# Altium schematic sheet 9.Pwm_Buffer.SchDoc
size A3; SheetNumber: 10; SheetTotal: 10
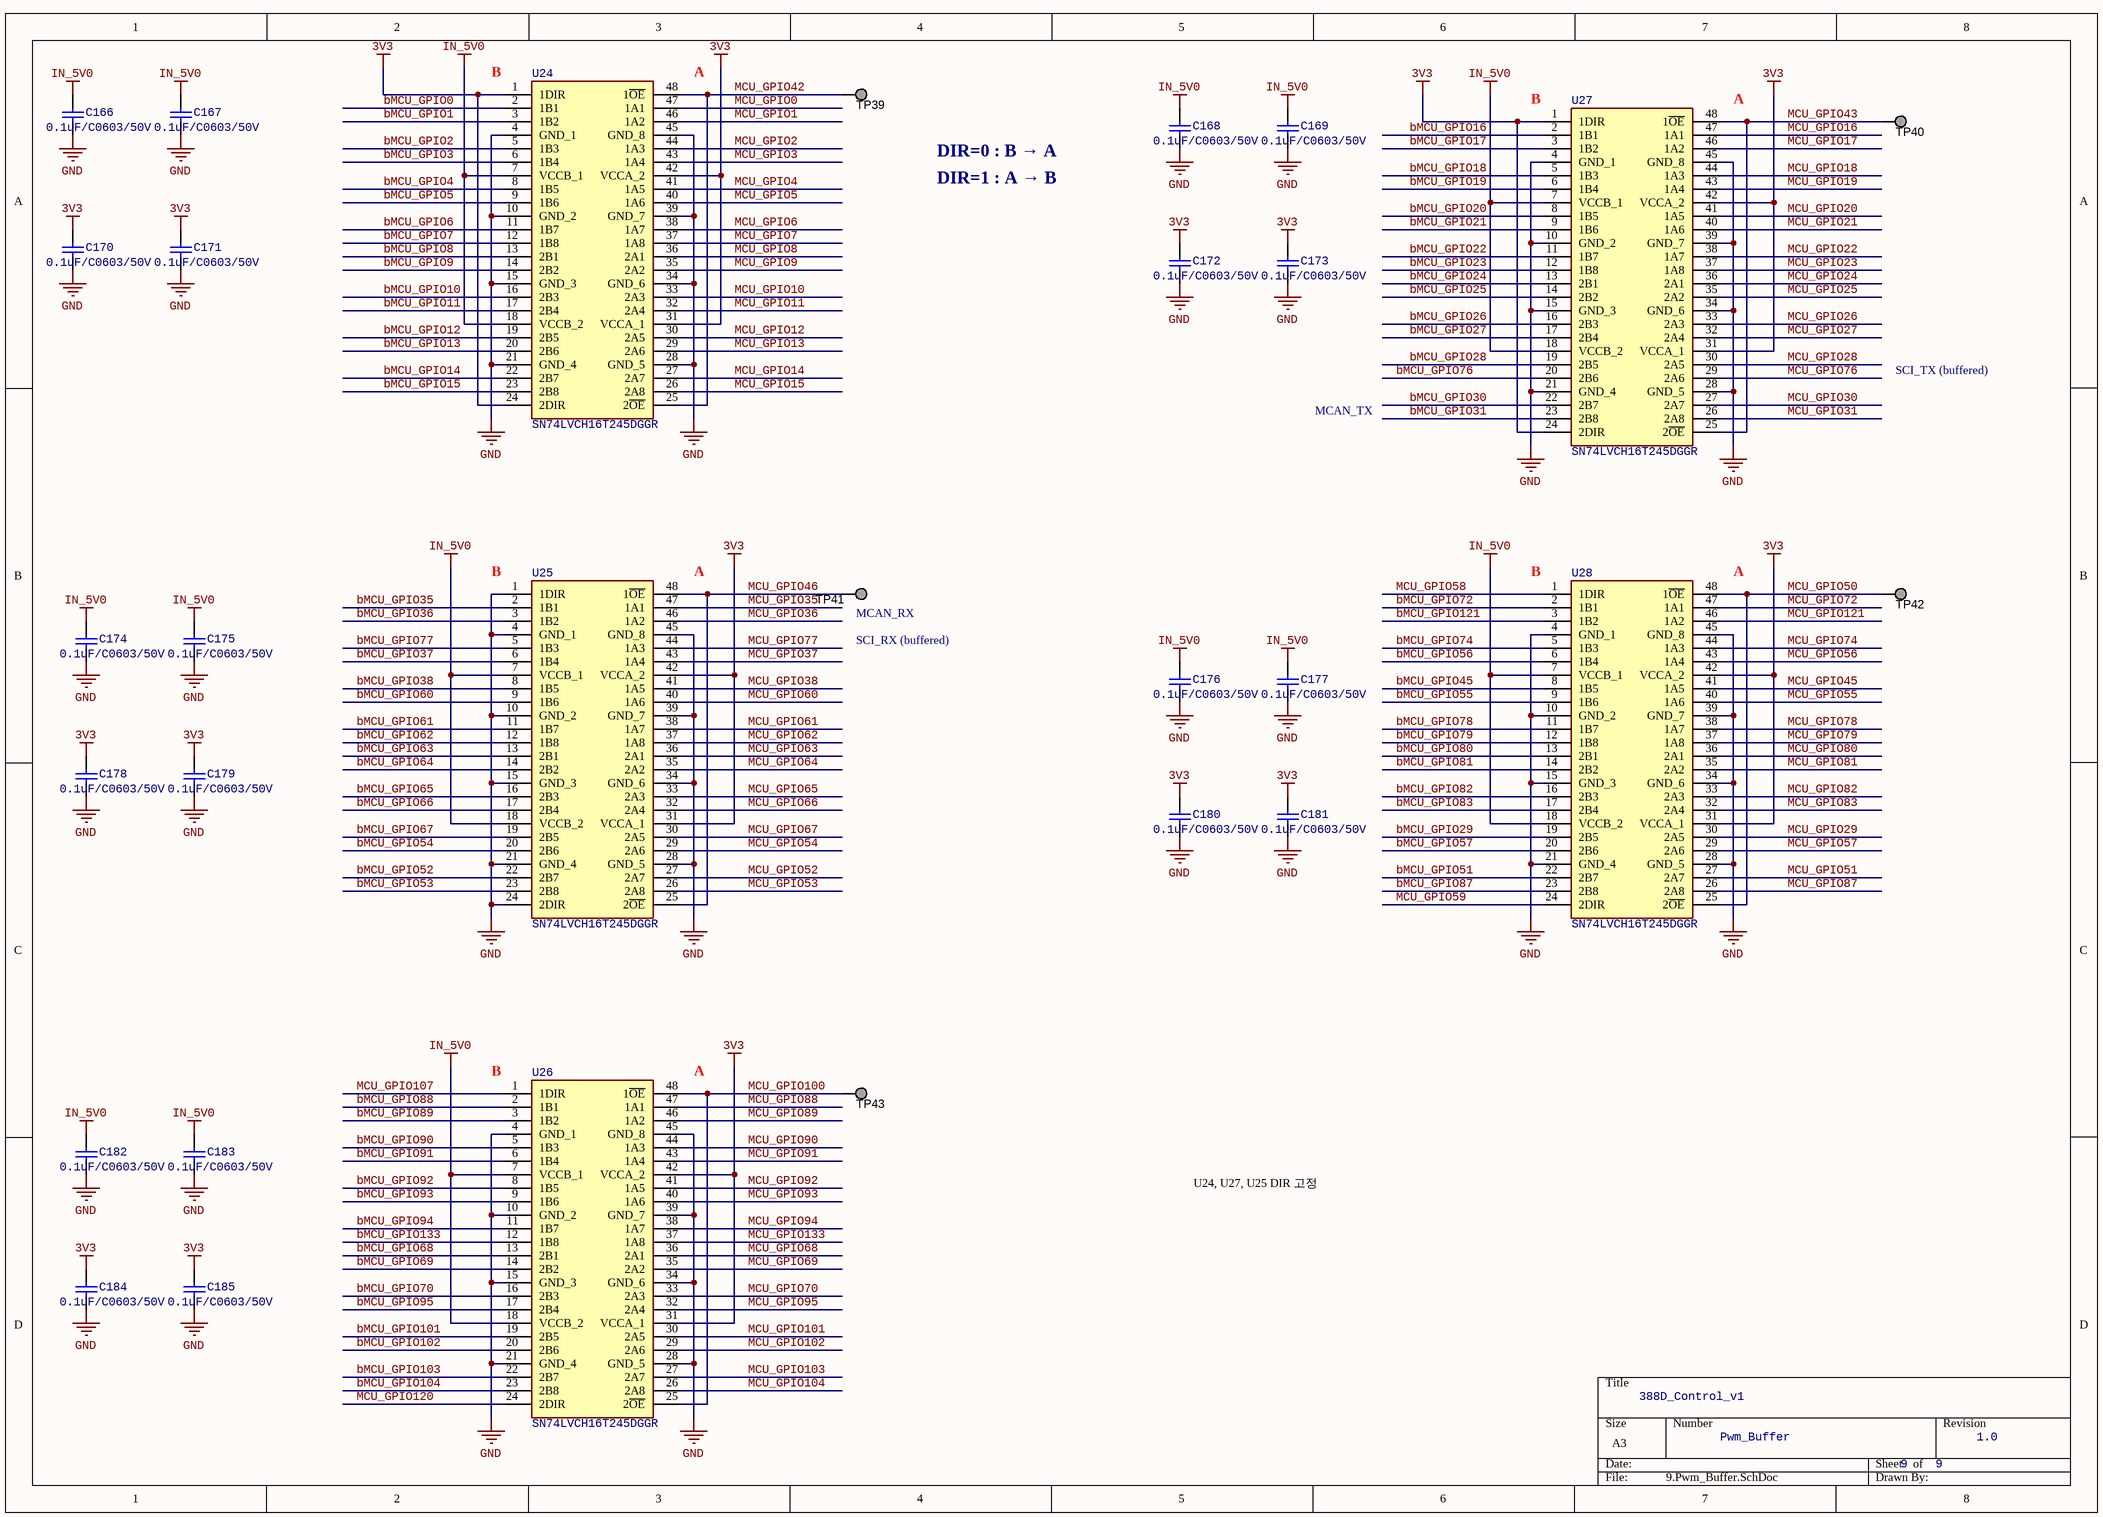
[diagram p0: 9.Pwm_Buffer.SchDoc]

## Parts
C166  value 0.1uF/C0603/50V  [CAPC1608X90X40NL10T20]  (hidden comment: Capacitor 100 nF +/-10% 50 V 0603)
C167  value 0.1uF/C0603/50V  [CAPC1608X90X40NL10T20]  (hidden comment: Capacitor 100 nF +/-10% 50 V 0603)
C168  value 0.1uF/C0603/50V  [CAPC1608X90X40NL10T20]  (hidden comment: Capacitor 100 nF +/-10% 50 V 0603)
C169  value 0.1uF/C0603/50V  [CAPC1608X90X40NL10T20]  (hidden comment: Capacitor 100 nF +/-10% 50 V 0603)
C170  value 0.1uF/C0603/50V  [CAPC1608X90X40NL10T20]  (hidden comment: Capacitor 100 nF +/-10% 50 V 0603)
C171  value 0.1uF/C0603/50V  [CAPC1608X90X40NL10T20]  (hidden comment: Capacitor 100 nF +/-10% 50 V 0603)
C172  value 0.1uF/C0603/50V  [CAPC1608X90X40NL10T20]  (hidden comment: Capacitor 100 nF +/-10% 50 V 0603)
C173  value 0.1uF/C0603/50V  [CAPC1608X90X40NL10T20]  (hidden comment: Capacitor 100 nF +/-10% 50 V 0603)
C174  value 0.1uF/C0603/50V  [CAPC1608X90X40NL10T20]  (hidden comment: Capacitor 100 nF +/-10% 50 V 0603)
C175  value 0.1uF/C0603/50V  [CAPC1608X90X40NL10T20]  (hidden comment: Capacitor 100 nF +/-10% 50 V 0603)
C176  value 0.1uF/C0603/50V  [CAPC1608X90X40NL10T20]  (hidden comment: Capacitor 100 nF +/-10% 50 V 0603)
C177  value 0.1uF/C0603/50V  [CAPC1608X90X40NL10T20]  (hidden comment: Capacitor 100 nF +/-10% 50 V 0603)
C178  value 0.1uF/C0603/50V  [CAPC1608X90X40NL10T20]  (hidden comment: Capacitor 100 nF +/-10% 50 V 0603)
C179  value 0.1uF/C0603/50V  [CAPC1608X90X40NL10T20]  (hidden comment: Capacitor 100 nF +/-10% 50 V 0603)
C180  value 0.1uF/C0603/50V  [CAPC1608X90X40NL10T20]  (hidden comment: Capacitor 100 nF +/-10% 50 V 0603)
C181  value 0.1uF/C0603/50V  [CAPC1608X90X40NL10T20]  (hidden comment: Capacitor 100 nF +/-10% 50 V 0603)
C182  value 0.1uF/C0603/50V  [CAPC1608X90X40NL10T20]  (hidden comment: Capacitor 100 nF +/-10% 50 V 0603)
C183  value 0.1uF/C0603/50V  [CAPC1608X90X40NL10T20]  (hidden comment: Capacitor 100 nF +/-10% 50 V 0603)
C184  value 0.1uF/C0603/50V  [CAPC1608X90X40NL10T20]  (hidden comment: Capacitor 100 nF +/-10% 50 V 0603)
C185  value 0.1uF/C0603/50V  [CAPC1608X90X40NL10T20]  (hidden comment: Capacitor 100 nF +/-10% 50 V 0603)
TP39  TESTPOINT  [TP_50MIL-25MILHOLE]  (value not drawn)  (no BOM)
TP40  TESTPOINT  [TP_50MIL-25MILHOLE]  (value not drawn)  (no BOM)
TP41  TESTPOINT  [TP_50MIL-25MILHOLE]  (value not drawn)  (no BOM)
TP42  TESTPOINT  [TP_50MIL-25MILHOLE]  (value not drawn)  (no BOM)
TP43  TESTPOINT  [TP_50MIL-25MILHOLE]  (value not drawn)  (no BOM)
U24  SN74LVCH16T245DGGR  [SOP50P810X120-48N]
U25  SN74LVCH16T245DGGR  [SOP50P810X120-48N]
U26  SN74LVCH16T245DGGR  [SOP50P810X120-48N]
U27  SN74LVCH16T245DGGR  [SOP50P810X120-48N]
U28  SN74LVCH16T245DGGR  [SOP50P810X120-48N]

## Nets
3V3: C170.1 C171.1 C172.1 C173.1 C178.1 C179.1 C180.1 C181.1 C184.1 C185.1 U24.1(1DIR) U24.24(2DIR) U24.31(VCCA_1) U24.42(VCCA_2) U25.31(VCCA_1) U25.42(VCCA_2) U26.31(VCCA_1) U26.42(VCCA_2) U27.1(1DIR) U27.24(2DIR) U27.31(VCCA_1) U27.42(VCCA_2) U28.31(VCCA_1) U28.42(VCCA_2)
GND: C166.2 C167.2 C168.2 C169.2 C170.2 C171.2 C172.2 C173.2 C174.2 C175.2 C176.2 C177.2 C178.2 C179.2 C180.2 C181.2 C182.2 C183.2 C184.2 C185.2 U24.4(GND_1) U24.10(GND_2) U24.15(GND_3) U24.21(GND_4) U24.28(GND_5) U24.34(GND_6) U24.39(GND_7) U24.45(GND_8) U25.1(1DIR) U25.4(GND_1) U25.10(GND_2) U25.15(GND_3) U25.21(GND_4) U25.24(2DIR) U25.28(GND_5) U25.34(GND_6) U25.39(GND_7) U25.45(GND_8) U26.4(GND_1) U26.10(GND_2) U26.15(GND_3) U26.21(GND_4) U26.28(GND_5) U26.34(GND_6) U26.39(GND_7) U26.45(GND_8) U27.4(GND_1) U27.10(GND_2) U27.15(GND_3) U27.21(GND_4) U27.28(GND_5) U27.34(GND_6) U27.39(GND_7) U27.45(GND_8) U28.4(GND_1) U28.10(GND_2) U28.15(GND_3) U28.21(GND_4) U28.28(GND_5) U28.34(GND_6) U28.39(GND_7) U28.45(GND_8)
IN_5V0: C166.1 C167.1 C168.1 C169.1 C174.1 C175.1 C176.1 C177.1 C182.1 C183.1 U24.7(VCCB_1) U24.18(VCCB_2) U25.7(VCCB_1) U25.18(VCCB_2) U26.7(VCCB_1) U26.18(VCCB_2) U27.7(VCCB_1) U27.18(VCCB_2) U28.7(VCCB_1) U28.18(VCCB_2)
bMCU_GPIO0: U24.2(1B1)
bMCU_GPIO1: U24.3(1B2)
bMCU_GPIO2: U24.5(1B3)
bMCU_GPIO3: U24.6(1B4)
bMCU_GPIO4: U24.8(1B5)
bMCU_GPIO5: U24.9(1B6)
bMCU_GPIO6: U24.11(1B7)
bMCU_GPIO7: U24.12(1B8)
bMCU_GPIO8: U24.13(2B1)
bMCU_GPIO9: U24.14(2B2)
bMCU_GPIO10: U24.16(2B3)
bMCU_GPIO11: U24.17(2B4)
bMCU_GPIO12: U24.19(2B5)
bMCU_GPIO13: U24.20(2B6)
bMCU_GPIO14: U24.22(2B7)
bMCU_GPIO15: U24.23(2B8)
bMCU_GPIO16: U27.2(1B1)
bMCU_GPIO17: U27.3(1B2)
bMCU_GPIO18: U27.5(1B3)
bMCU_GPIO19: U27.6(1B4)
bMCU_GPIO20: U27.8(1B5)
bMCU_GPIO21: U27.9(1B6)
bMCU_GPIO22: U27.11(1B7)
bMCU_GPIO23: U27.12(1B8)
bMCU_GPIO24: U27.13(2B1)
bMCU_GPIO25: U27.14(2B2)
bMCU_GPIO26: U27.16(2B3)
bMCU_GPIO27: U27.17(2B4)
bMCU_GPIO28: U27.19(2B5)
bMCU_GPIO29: U28.19(2B5)
bMCU_GPIO30: U27.22(2B7)
bMCU_GPIO31: U27.23(2B8)
bMCU_GPIO35: U25.2(1B1)
bMCU_GPIO36: U25.3(1B2)
bMCU_GPIO37: U25.6(1B4)
bMCU_GPIO38: U25.8(1B5)
bMCU_GPIO45: U28.8(1B5)
bMCU_GPIO51: U28.22(2B7)
bMCU_GPIO52: U25.22(2B7)
bMCU_GPIO53: U25.23(2B8)
bMCU_GPIO54: U25.20(2B6)
bMCU_GPIO55: U28.9(1B6)
bMCU_GPIO56: U28.6(1B4)
bMCU_GPIO57: U28.20(2B6)
bMCU_GPIO60: U25.9(1B6)
bMCU_GPIO61: U25.11(1B7)
bMCU_GPIO62: U25.12(1B8)
bMCU_GPIO63: U25.13(2B1)
bMCU_GPIO64: U25.14(2B2)
bMCU_GPIO65: U25.16(2B3)
bMCU_GPIO66: U25.17(2B4)
bMCU_GPIO67: U25.19(2B5)
bMCU_GPIO68: U26.13(2B1)
bMCU_GPIO69: U26.14(2B2)
bMCU_GPIO70: U26.16(2B3)
bMCU_GPIO72: U28.2(1B1)
bMCU_GPIO74: U28.5(1B3)
bMCU_GPIO76: U27.20(2B6)
bMCU_GPIO77: U25.5(1B3)
bMCU_GPIO78: U28.11(1B7)
bMCU_GPIO79: U28.12(1B8)
bMCU_GPIO80: U28.13(2B1)
bMCU_GPIO81: U28.14(2B2)
bMCU_GPIO82: U28.16(2B3)
bMCU_GPIO83: U28.17(2B4)
bMCU_GPIO87: U28.23(2B8)
bMCU_GPIO88: U26.2(1B1)
bMCU_GPIO89: U26.3(1B2)
bMCU_GPIO90: U26.5(1B3)
bMCU_GPIO91: U26.6(1B4)
bMCU_GPIO92: U26.8(1B5)
bMCU_GPIO93: U26.9(1B6)
bMCU_GPIO94: U26.11(1B7)
bMCU_GPIO95: U26.17(2B4)
bMCU_GPIO101: U26.19(2B5)
bMCU_GPIO102: U26.20(2B6)
bMCU_GPIO103: U26.22(2B7)
bMCU_GPIO104: U26.23(2B8)
bMCU_GPIO121: U28.3(1B2)
bMCU_GPIO133: U26.12(1B8)
MCU_GPIO0: U24.47(1A1)
MCU_GPIO1: U24.46(1A2)
MCU_GPIO2: U24.44(1A3)
MCU_GPIO3: U24.43(1A4)
MCU_GPIO4: U24.41(1A5)
MCU_GPIO5: U24.40(1A6)
MCU_GPIO6: U24.38(1A7)
MCU_GPIO7: U24.37(1A8)
MCU_GPIO8: U24.36(2A1)
MCU_GPIO9: U24.35(2A2)
MCU_GPIO10: U24.33(2A3)
MCU_GPIO11: U24.32(2A4)
MCU_GPIO12: U24.30(2A5)
MCU_GPIO13: U24.29(2A6)
MCU_GPIO14: U24.27(2A7)
MCU_GPIO15: U24.26(2A8)
MCU_GPIO16: U27.47(1A1)
MCU_GPIO17: U27.46(1A2)
MCU_GPIO18: U27.44(1A3)
MCU_GPIO19: U27.43(1A4)
MCU_GPIO20: U27.41(1A5)
MCU_GPIO21: U27.40(1A6)
MCU_GPIO22: U27.38(1A7)
MCU_GPIO23: U27.37(1A8)
MCU_GPIO24: U27.36(2A1)
MCU_GPIO25: U27.35(2A2)
MCU_GPIO26: U27.33(2A3)
MCU_GPIO27: U27.32(2A4)
MCU_GPIO28: U27.30(2A5)
MCU_GPIO29: U28.30(2A5)
MCU_GPIO30: U27.27(2A7)
MCU_GPIO31: U27.26(2A8)
MCU_GPIO35: U25.47(1A1)
MCU_GPIO36: U25.46(1A2)
MCU_GPIO37: U25.43(1A4)
MCU_GPIO38: U25.41(1A5)
MCU_GPIO42: TP39.1 U24.25(2~{OE}) U24.48(1~{OE})
MCU_GPIO43: TP40.1 U27.25(2~{OE}) U27.48(1~{OE})
MCU_GPIO45: U28.41(1A5)
MCU_GPIO46: TP41.1 U25.25(2~{OE}) U25.48(1~{OE})
MCU_GPIO50: TP42.1 U28.25(2~{OE}) U28.48(1~{OE})
MCU_GPIO51: U28.27(2A7)
MCU_GPIO52: U25.27(2A7)
MCU_GPIO53: U25.26(2A8)
MCU_GPIO54: U25.29(2A6)
MCU_GPIO55: U28.40(1A6)
MCU_GPIO56: U28.43(1A4)
MCU_GPIO57: U28.29(2A6)
MCU_GPIO58: U28.1(1DIR)
MCU_GPIO59: U28.24(2DIR)
MCU_GPIO60: U25.40(1A6)
MCU_GPIO61: U25.38(1A7)
MCU_GPIO62: U25.37(1A8)
MCU_GPIO63: U25.36(2A1)
MCU_GPIO64: U25.35(2A2)
MCU_GPIO65: U25.33(2A3)
MCU_GPIO66: U25.32(2A4)
MCU_GPIO67: U25.30(2A5)
MCU_GPIO68: U26.36(2A1)
MCU_GPIO69: U26.35(2A2)
MCU_GPIO70: U26.33(2A3)
MCU_GPIO72: U28.47(1A1)
MCU_GPIO74: U28.44(1A3)
MCU_GPIO76: U27.29(2A6)
MCU_GPIO77: U25.44(1A3)
MCU_GPIO78: U28.38(1A7)
MCU_GPIO79: U28.37(1A8)
MCU_GPIO80: U28.36(2A1)
MCU_GPIO81: U28.35(2A2)
MCU_GPIO82: U28.33(2A3)
MCU_GPIO83: U28.32(2A4)
MCU_GPIO87: U28.26(2A8)
MCU_GPIO88: U26.47(1A1)
MCU_GPIO89: U26.46(1A2)
MCU_GPIO90: U26.44(1A3)
MCU_GPIO91: U26.43(1A4)
MCU_GPIO92: U26.41(1A5)
MCU_GPIO93: U26.40(1A6)
MCU_GPIO94: U26.38(1A7)
MCU_GPIO95: U26.32(2A4)
MCU_GPIO100: TP43.1 U26.25(2~{OE}) U26.48(1~{OE})
MCU_GPIO101: U26.30(2A5)
MCU_GPIO102: U26.29(2A6)
MCU_GPIO103: U26.27(2A7)
MCU_GPIO104: U26.26(2A8)
MCU_GPIO107: U26.1(1DIR)
MCU_GPIO120: U26.24(2DIR)
MCU_GPIO121: U28.46(1A2)
MCU_GPIO133: U26.37(1A8)

## Notes on the sheet
- (near U24) B
- (near U24) A
- (near U27) B
- (near U27) A
- DIR=0 : B → A
- DIR=1 : A → B
- SCI_TX (buffered)
- MCAN_TX
- (near U25) B
- (near U25) A
- (near U28) B
- (near U28) A
- (near TP41) MCAN_RX
- (near TP41) SCI_RX (buffered)
- (near U26) B
- (near U26) A
- U24, U27, U25 DIR 고정
- 388D_Control_v1
- Pwm_Buffer
- 9    9
- 1.0

## Library data of the parts
C166-C185 = CMP-001-00017-6: Chip Capacitor, 100 nF, +/- 10%, 50 V, 0603 (1608 Metric); Voltage Rating: 50V; Capacitor Type: Ceramic; Tolerance: 10%; Mounting Technology: SM; Max Operating Temperature: 125°C; RoHS Compliant: True; Pins: 2; Case/Package: 0603; Min Operating Temperature: -55°C
TP39-TP43 = CMP-0078143-3: TEST POINT.  No entry in BOM.; CompType: Testpoint; PackageReference: N/A; Manufacturer: N/A; PartNumber: N/A; Library Reference: TESTPOINT
U24-U28 = CMP-031-00095-1: 16-Bit Dual-Supply Bus Transceiver; Manufacturer_Name: Texas Instruments; Arrow Part Number: SN74LVCH16T245DGGR; Source: 388D_Control_v1.SchLib; Arrow Price/Stock: https://www.arrow.com/en/products/sn74lvch16t245dggr/texas-instruments; Height: 1.2mm; Mouser Part Number: 595-SN74LVCH16T245GR; Manufacturer_Part_Number: SN74LVCH16T245DGGR; Datasheet Link: http://www.ti.com/lit/gpn/sn74lvch16t245; Mouser Price/Stock: https://www.mouser.co.uk/ProductDetail/Texas-Instruments/SN74LVCH16T245DGGR?qs=dT9u2OTAaVU%2FCf3PTalIAw%3D%3D; Design Item ID: SN74LVCH16T245DGGR